# Altium schematic sheet XC6204_1V8.SchDoc
size A4; SheetNumber: 11; SheetTotal: 27
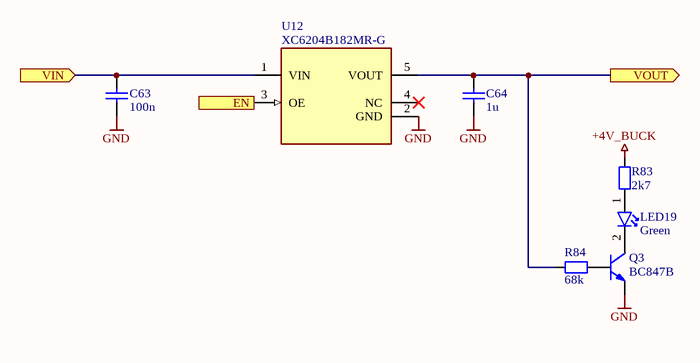
[diagram p0: XC6204_1V8.SchDoc]

## Parts
C63  100n  [C_0603_1608Metric_IPC_N]
C64  1u  [C_0603_1608Metric_IPC_N]
LED19  Green  [LED_0603_1806Metric_IPC_N]
Q3  BC847B  [SOT-23-3]
R83  2k7  [R_0402_1005Metric_IPC_N]
R84  68k  [R_0402_1005Metric_IPC_N]
U12  XC6204B182MR-G  [SOT-23-5]

## Ports
EN (in, see Power_Supply[5D]), VIN (in, see Power_Supply[5C], LT3042_3V3[2B], LT3045_3V3[2B], TLV755P_3V3[2B]), VOUT (out, see Power_Supply[6D])

## Nets
+4V_BUCK: R83.2
GND: C63.1 C64.1 Q3.2(E) U12.2(GND)
EN: U12.3(OE) ; port EN
VIN: C63.2 U12.1(VIN) ; port VIN
VOUT: C64.2 R84.1 U12.5(VOUT) ; port VOUT
NetLED19_1: LED19.1 R83.1
NetLED19_2: LED19.2 Q3.3(C)
NetQ3_1: Q3.1(B) R84.2

Not connected (* = marked no-connect by the designer): U12 4(NC)*

## Library data of the parts
C63 C64 = C000003: Generic MLCC with 0603 Footprint; Specific Component: False; Temp Coefficient: X7R; Voltage Rated: 15V; ID: C000003; Tolerance: *; min Temperature: *; max Temperature: *; Case: 0603
  C63: Capacitance: 100n
  C64: Capacitance: 1u
LED19 = LED000007: MLCC, Low Current, Green, 2.2V, 20mA, 0603; Manufacturer: Broadcom / Avago; Manufacturer Part Number: HSMG-C190; Specific Component: True; ID: LED000007; Type: Low Current; Colour: Green; Forward Voltage: 2.2V; Current: 20mA; Case: 0603; ComponentLink1Description: Datasheet; ComponentLink1URL: https://www.mouser.de/datasheet/3/57/1/AV02_0551EN_DS_HSMx_Cxxx_25Mar2022.pdf; Supplier 1: Mouser; Supplier Part Number 1: 630-HSMG-C190; Supplier 2: Digikey; Supplier Part Number 2: 516-1425-1-ND
Q3 = PMIC000033: Manufacturer: Diotec Semiconductor; ID: PMIC000033; Type: NPN; Manufacturer Part Number: BC847B; Part Value: BC847B; Case: SOT-23-3; ComponentLink1Description: Datasheet; ComponentLink1URL: https://diotec.com/request/datasheet/bc846.pdf; Supplier 1: Digikey; Supplier Part Number 1: 4878-BC847BCT-ND; Supplier 2: Mouser; Supplier Part Number 2: 637-BC847B
R83 R84 = R000002: Generic Chip Resistor with 0402 Footprint; Specific Component: False; ID: R000002; Tolerance: *; Power Rating: *; Composition: *; min Temperature: *; max Temperature: *; Temp Coefficient: *; Case: 0402
  R83: Resistance: 2k7
  R84: Resistance: 68k
U12 = PMIC000005: Manufacturer: Torex Semiconductor; ID: PMIC000005; Type: LDO; Manufacturer Part Number: XC6204B182MR-G; Part Value: XC6204B182MR-G; Case: SOT-25-5; ComponentLink1Description: Datasheet; ComponentLink1URL: https://product.torexsemi.com/system/files/series/xc6204.pdf; Supplier 1: Digikey; Supplier Part Number 1: 893-1060-1-ND; Supplier 2: Mouser; Supplier Part Number 2: 865-XC6204B182MR-G